# EAGLE design Interfacing board updated (EAGLE 6.2)
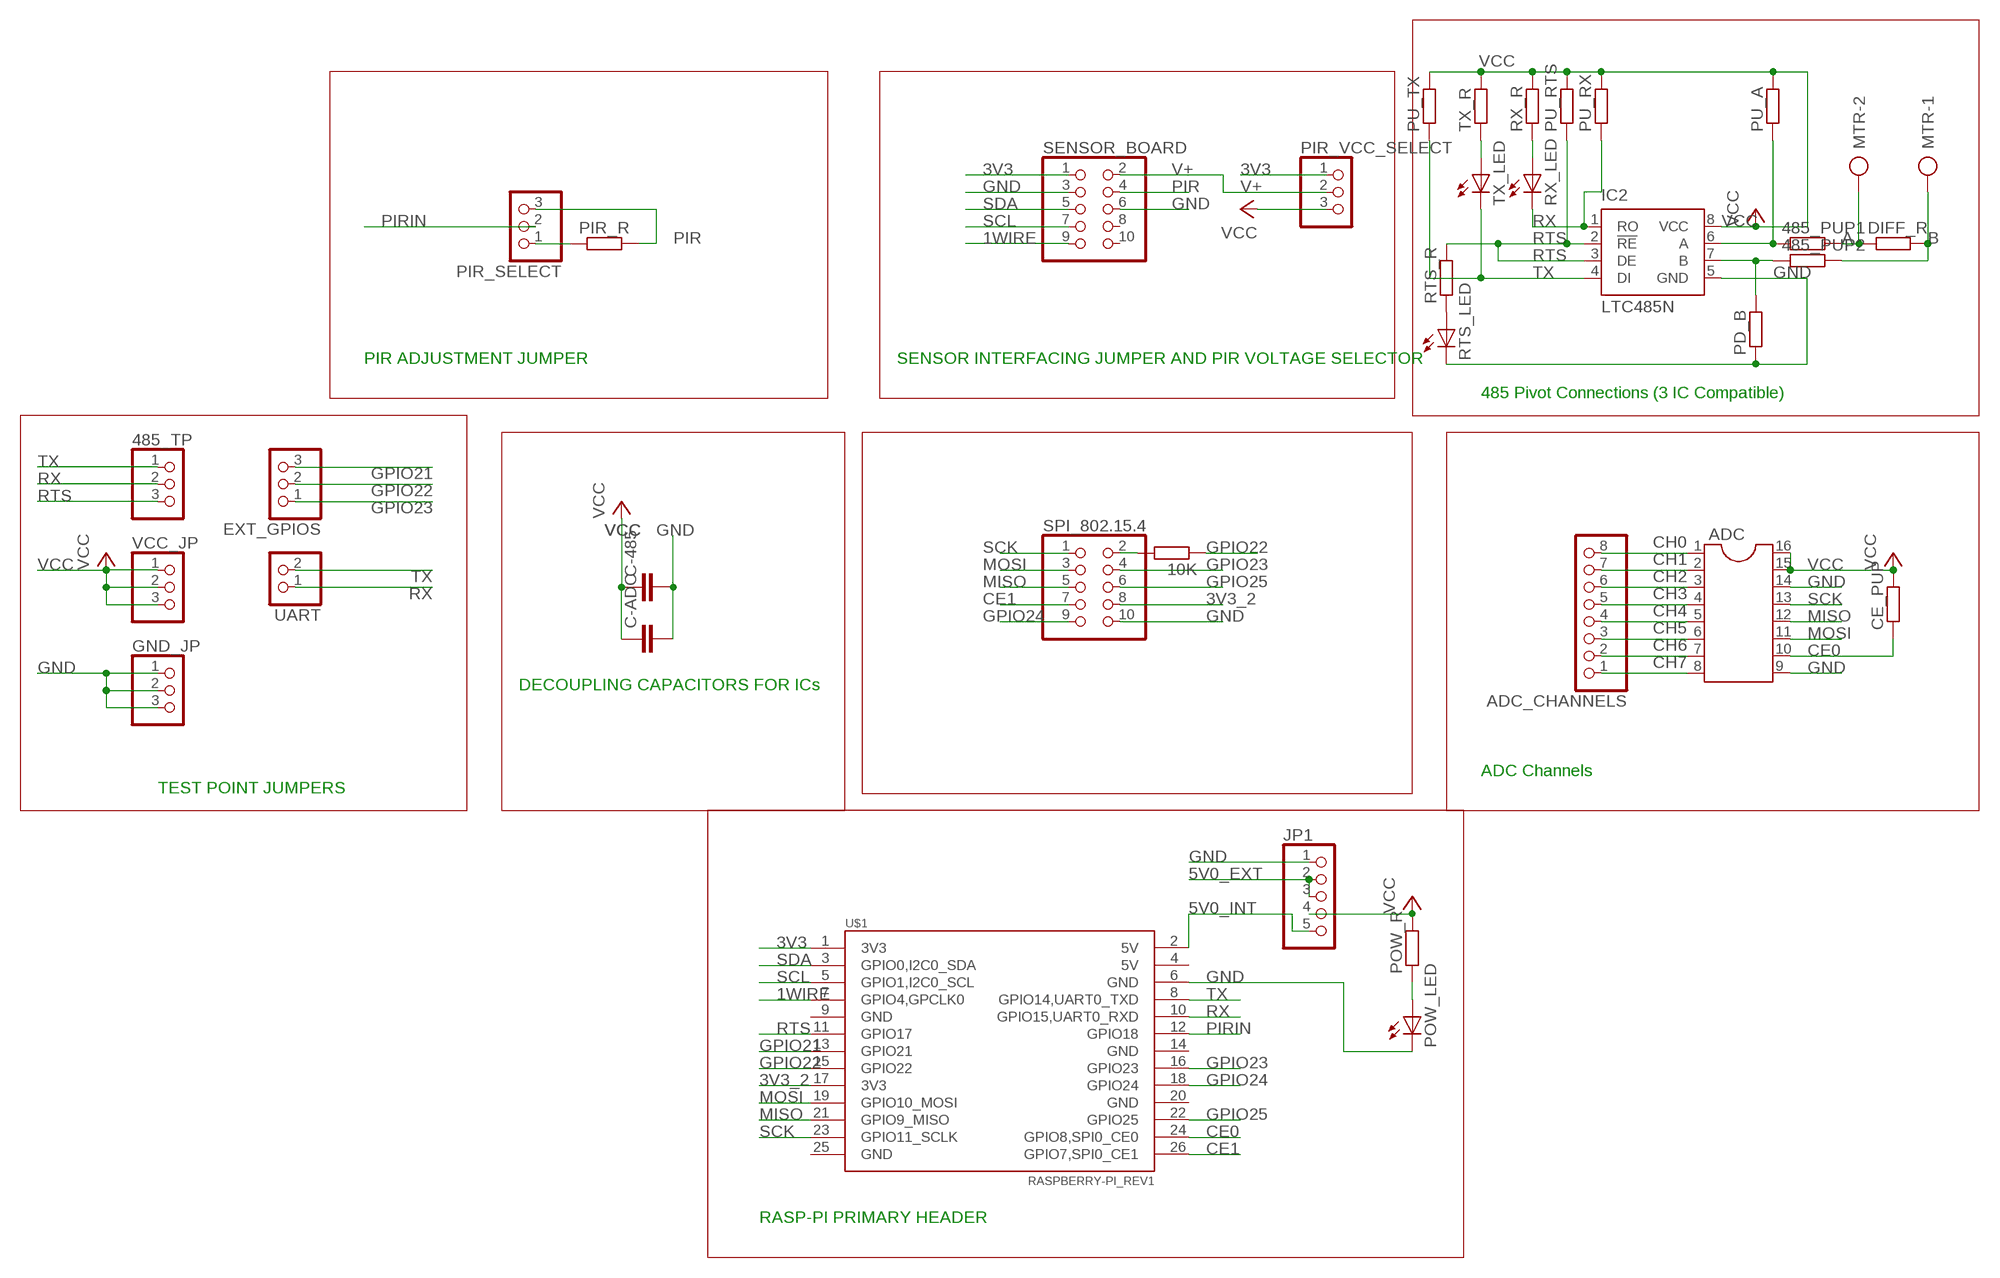
[diagram p0: schematic, sheet 1]

## Parts
10K  R-EU_R0603  [R0603]
485_PUP1  R-EU_R0603  [R0603]
485_PUP2  R-EU_R0603  [R0603]
485_TP  PINHD-1X3/90  [1X03/90]
ADC  DIL16  [DIL16]
ADC_CHANNELS  PINHD-1X8/90  [1X08/90]
C-485  C-EU025-025X050  [C025-025X050]
C-ADC  C-EU025-025X050  [C025-025X050]
CE_PUP  R-EU_R0603  [R0603]
DIFF_R  R-EU_R0603  [R0603]
EXT_GPIOS  PINHD-1X3/90  [1X03/90]
GND_JP  PINHD-1X3/90  [1X03/90]
IC2  LTC485N  [DIL08]
JP1  PINHD-1X5  [1X05]
MTR  AK500/2-H  [AK500/2-H]
PD_B  R-EU_R0603  [R0603]
PIR_R  R-EU_R0603  [R0603]
PIR_SELECT  PINHD-1X3/90  [1X03/90]
PIR_VCC_SELECT  PINHD-1X3/90  [1X03/90]
POW_LED  LEDCHIPLED_0805  [CHIPLED_0805]
POW_R  R-EU_R0603  [R0603]
PU_A  R-EU_R0603  [R0603]
PU_RTS  R-EU_R0603  [R0603]
PU_RX  R-EU_R0603  [R0603]
PU_TX  R-EU_R0603  [R0603]
RTS_LED  LEDCHIPLED_0805  [CHIPLED_0805]
RTS_R  R-EU_R0603  [R0603]
RX_LED  LEDCHIPLED_0805  [CHIPLED_0805]
RX_R  R-EU_R0603  [R0603]
SENSOR_BOARD  PINHD-2X5/90  [2X05/90]
SPI_802.15.4  PINHD-2X5/90  [2X05/90]
TX_LED  LEDCHIPLED_0805  [CHIPLED_0805]
TX_R  R-EU_R0603  [R0603]
U$1  RASPBERRY-PI_REV1  [RASPBERRY-PI_REV1]
UART  PINHD-1X2  [1X02]
VCC_JP  PINHD-1X3/90  [1X03/90]

## Nets
1WIRE: SENSOR_BOARD.9 U$1.7(GPIO4,GPCLK0)
3V3: PIR_VCC_SELECT.1 SENSOR_BOARD.1 U$1.1(3V3)
3V3_2: SPI_802.15.4.8 U$1.17(3V3)
5V0_EXT: JP1.2 JP1.3
5V0_INT: JP1.5 U$1.2(5V)
A: 485_PUP1.2 DIFF_R.1 MTR.2
B: 485_PUP2.2 DIFF_R.2 MTR.1
CE0: ADC.10 CE_PUP.1 U$1.24(GPIO8,SPI0_CE0)
CE1: SPI_802.15.4.7 U$1.26(GPIO7,SPI0_CE1)
CH0: ADC.1 ADC_CHANNELS.8
CH1: ADC.2 ADC_CHANNELS.7
CH2: ADC.3 ADC_CHANNELS.6
CH3: ADC.4 ADC_CHANNELS.5
CH4: ADC.5 ADC_CHANNELS.4
CH5: ADC.6 ADC_CHANNELS.3
CH6: ADC.7 ADC_CHANNELS.2
CH7: ADC.8 ADC_CHANNELS.1
GND: ADC.9 ADC.14 C-485.2 C-ADC.2 GND_JP.1 GND_JP.2 GND_JP.3 IC2.5(GND) JP1.1 PD_B.1 POW_LED.C RTS_LED.C SENSOR_BOARD.3 SENSOR_BOARD.6 SPI_802.15.4.10 U$1.6(GND)
GPIO21: EXT_GPIOS.3 U$1.13(GPIO21)
GPIO22: 10K.1 EXT_GPIOS.2 U$1.15(GPIO22)
GPIO23: EXT_GPIOS.1 SPI_802.15.4.4 U$1.16(GPIO23)
GPIO24: SPI_802.15.4.9 U$1.18(GPIO24)
GPIO25: SPI_802.15.4.6 U$1.22(GPIO25)
MISO: ADC.12 SPI_802.15.4.5 U$1.21(GPIO9_MISO)
MOSI: ADC.11 SPI_802.15.4.3 U$1.19(GPIO10_MOSI)
N$1: 485_PUP1.1 IC2.6(A) PU_A.1
N$2: 485_PUP2.1 IC2.7(B) PD_B.2
N$3: PIR_R.1 PIR_SELECT.1
N$4: POW_LED.A POW_R.1
N$7: RTS_LED.A RTS_R.1
N$14: 10K.2 SPI_802.15.4.2
PIR: PIR_R.2 PIR_SELECT.3 SENSOR_BOARD.4
PIRIN: PIR_SELECT.2 U$1.12(GPIO18)
RTS: 485_TP.3 IC2.2(!RE) IC2.3(DE) PU_RTS.1 RTS_R.2 U$1.11(GPIO17)
RX: 485_TP.2 IC2.1(RO) PU_RX.1 RX_LED.C U$1.10(GPIO15,UART0_RXD) UART.1
RX_R: RX_LED.A RX_R.1
SCK: ADC.13 SPI_802.15.4.1 U$1.23(GPIO11_SCLK)
SCL: SENSOR_BOARD.7 U$1.5(GPIO1,I2C0_SCL)
SDA: SENSOR_BOARD.5 U$1.3(GPIO0,I2C0_SDA)
TX: 485_TP.1 IC2.4(DI) PU_TX.1 TX_LED.C U$1.8(GPIO14,UART0_TXD) UART.2
TX_R: TX_LED.A TX_R.1
V+: PIR_VCC_SELECT.2 SENSOR_BOARD.2
VCC: ADC.15 ADC.16 C-485.1 C-ADC.1 CE_PUP.2 IC2.8(VCC) JP1.4 PIR_VCC_SELECT.3 POW_R.2 PU_A.2 PU_RTS.2 PU_RX.2 PU_TX.2 RX_R.2 TX_R.2 VCC_JP.1 VCC_JP.2 VCC_JP.3
Unconnected: SENSOR_BOARD.8 SENSOR_BOARD.10 U$1.4(5V) U$1.9(GND) U$1.14(GND) U$1.20(GND) U$1.25(GND)

## Notes on the sheet
- PIR ADJUSTMENT JUMPER | SENSOR INTERFACING JUMPER AND PIR VOLTAGE SELECTOR
- 485 Pivot Connections (3 IC Compatible)
- DECOUPLING CAPACITORS FOR ICs
- ADC Channels
- TEST POINT JUMPERS
- RASP-PI PRIMARY HEADER

## Library data of the parts
10K 485_PUP1 485_PUP2 CE_PUP DIFF_R PD_B PIR_R POW_R PU_A PU_RTS PU_RX PU_TX RTS_R RX_R TX_R = rcl:R-EU_: RESISTOR, European symbol
485_TP EXT_GPIOS GND_JP PIR_SELECT PIR_VCC_SELECT VCC_JP = pinhead:PINHD-1X3: PIN HEADER
ADC = ic-package:DIL16: Dual In Line / Socket
ADC_CHANNELS = pinhead:PINHD-1X8: PIN HEADER
C-485 C-ADC = rcl:C-EU: CAPACITOR, European symbol
IC2 = linear-technology:LTC485: Low Power RS485 Interface Transceiver Source: http://www.linear.com/pc/downloadDocument.do?navId=H0,C1,C1007,C1017,P2064,D1718; OC_FARNELL: unknown; OC_NEWARK: unknown
JP1 = pinhead:PINHD-1X5: PIN HEADER
MTR = con-ptr500:AK500/2-H: CONNECTOR Aug. 2004 / PTR Meßtechnik: Die Bezeichnung der Serie AK505 wurde geändert. Es handelt sich hierbei um AK500 in horizontaler Ausführung.; OC_FARNELL: unknown; OC_NEWARK: unknown
POW_LED RTS_LED RX_LED TX_LED = led:LED: LED OSRAM: - CHIPLED LG R971, LG N971, LY N971, LG Q971, LY Q971, LO R971, LY R971 LH N974, LH R974 LS Q976, LO Q976, LY Q976 LO Q996 - Hyper CHIPLED LW Q18S LB Q993, LB Q99A, LB R99A - SideLED LS A670, LO A670, LY A670, LG A670, LP A670 LB A673, LV A673, LT A673, LW A673 LH A674 LY A675 LS A676, LA A676, LO A676, LY A676, LW A676 LS A679, LY A679, LG A679 - Hyper Micro SIDELED® LS Y876, LA Y876, LO Y876, LY Y876 LT Y87S - SmartLED LW L88C, LW L88S LB L89C, LB L89S, LG L890 LS L89K, LO L89K, LY L89K LS L896, LA L896, LO L896, LY L896 - TOPLED LS T670, LO T670, LY T670, LG T670, LP T670 LSG T670, LSP T670, LSY T670, LOP T670, LYG T670 LG T671, LOG T671, LSG T671 LB T673, LV T673, LT T673, LW T673 LH T674 LS T676, LA T676, LO T676, LY T676, LB T676, LH T676, LSB T676, LW T676 LB T67C, LV T67C, LT T67C, LS T67K, LO T67K, LY T67K, LW E67C LS E67B, LA E67B, LO E67B, LY E67B, LB E67C, LV E67C, LT E67C LW T67C LS T679, LY T679, LG T679 LS T770, LO T770, LY T770, LG T770, LP T770 LB T773, LV T773, LT T773, LW T773 LH T774 LS E675, LA E675, LY E675, LS T675 LS T776, LA T776, LO T776, LY T776, LB T776 LHGB T686 LT T68C, LB T68C - Hyper Mini TOPLED® LB M676 - Mini TOPLED Santana® LG M470 LS M47K, LO M47K, LY M47K Source: http://www.osram.convergy.de LUXEON: - LUMILED® LXK2-PW12-R00, LXK2-PW12-S00, LXK2-PW14-U00, LXK2-PW14-V00 LXK2-PM12-R00, LXK2-PM12-S00, LXK2-PM14-U00 LXK2-PE12-Q00, LXK2-PE12-R00, LXK2-PE12-S00, LXK2-PE14-T00, LXK2-PE14-U00 LXK2-PB12-K00, LXK2-PB12-L00, LXK2-PB12-M00, LXK2-PB14-N00, LXK2-PB14-P00, LXK2-PB14-Q00 LXK2-PR12-L00, LXK2-PR12-M00, LXK2-PR14-Q00, LXK2-PR14-R00 LXK2-PD12-Q00, LXK2-PD12-R00, LXK2-PD12-S00 LXK2-PH12-R00, LXK2-PH12-S00 LXK2-PL12-P00, LXK2-PL12-Q00, LXK2-PL12-R00 Source: www.luxeon.com KINGBRIGHT: KA-3528ASYC Source: www.kingbright.com
SENSOR_BOARD SPI_802.15.4 = pinhead:PINHD-2X5: PIN HEADER
U$1 = RaspberryPi:RASPBERRY-PI_REV1: Raspberry Pi Board <http://www.raspberrypi.org/> Jacques Lagnel V1.0 (beta) 2012 Mateusz Bawaj V1.1 (beta) 2012 Board dimension: Forum 3D model <http://www.raspberrypi.org/forum/general-discussion/mechanical-profile-3d-models?value=3d%20model&type=1&include=1&search=1&ret=all> The GPIO Connector (P1): http://elinux.org/RPi_Low-level_peripherals
UART = pinhead:PINHD-1X2: PIN HEADER

## Board
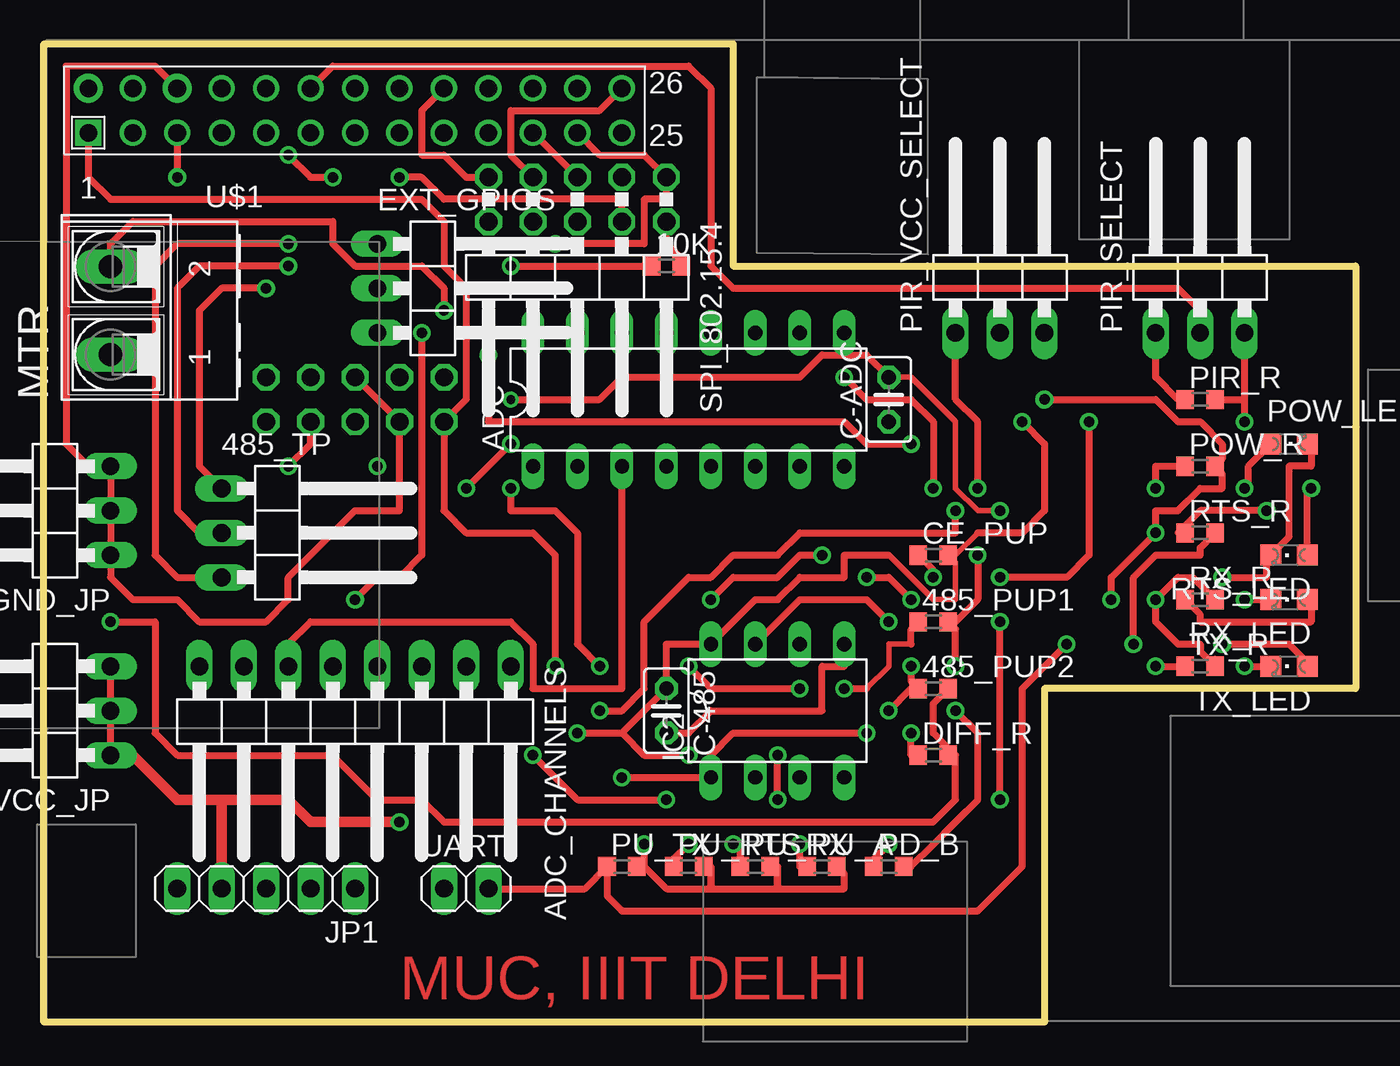
[diagram p1: board, top side]
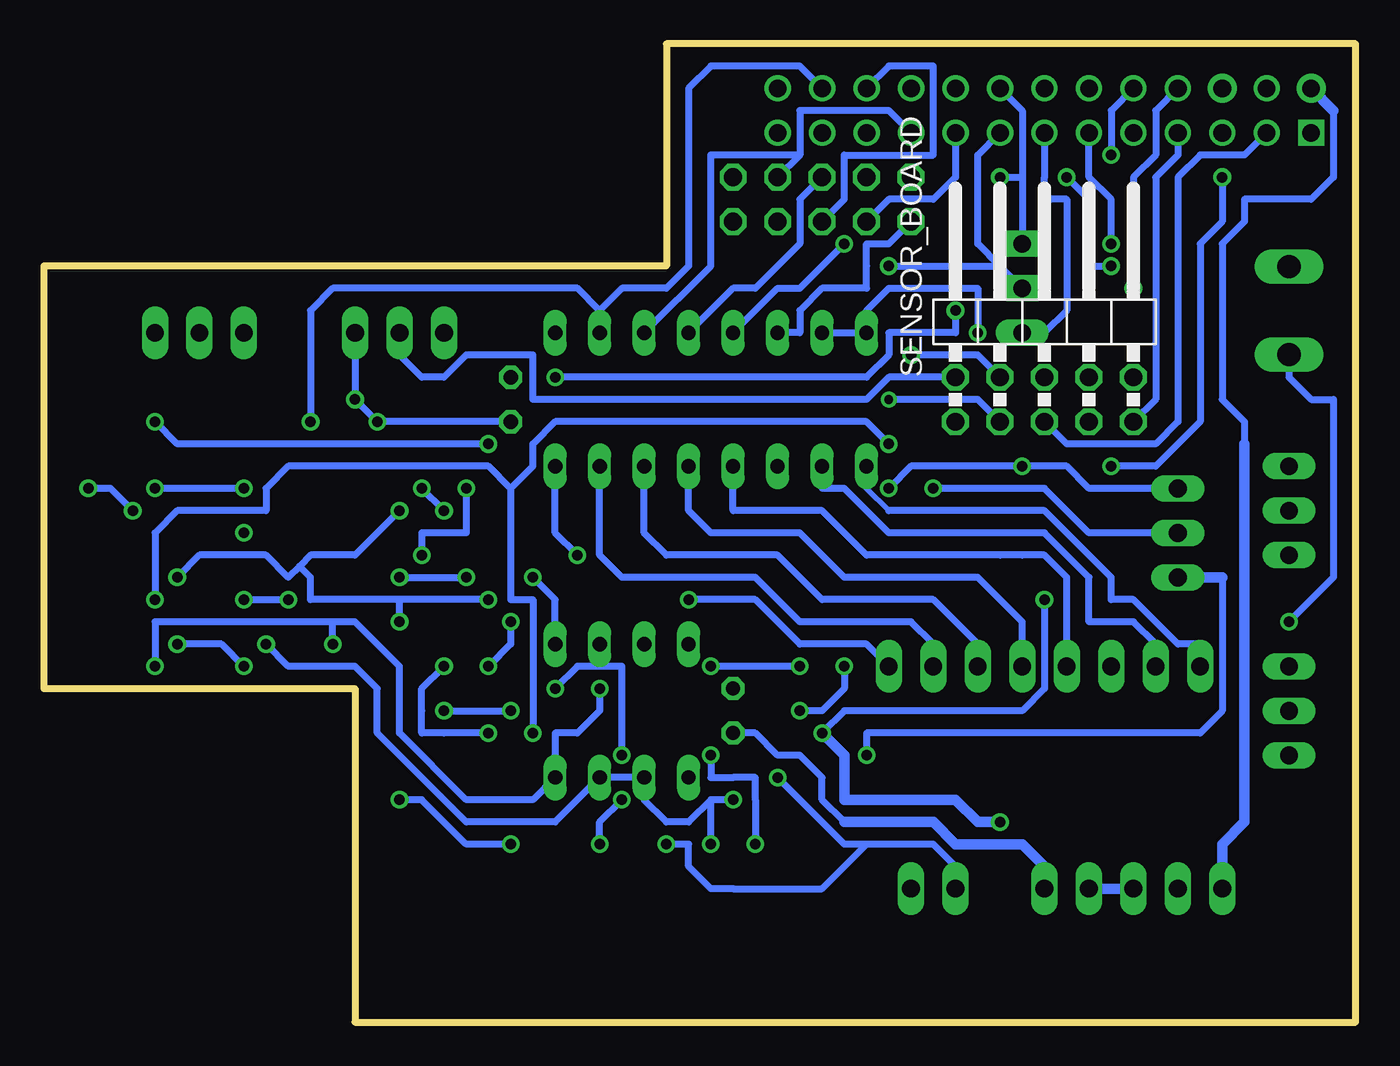
[diagram p2: board, bottom side, seen from below]

Size 74.93 x 55.88 mm. Coordinates in mm from the lower left corner, seen from the top.
Outline: 0,55.88 39.37,55.88 39.37,43.18 74.93,43.18 74.93,19.05 57.15,19.05 57.15,0 0,0 0,55.88
Copper layers (1*16): Top 0.035mm / dielectric 1.5mm / Bottom 0.035mm
Design rules: minimum track width 12mil, minimum drill 15mil, track to track 8mil, track to pad 8mil, pad to pad 8mil, via to via 8mil, smd to smd 8mil, copper to edge 40mil, drill to drill 8mil, minimum pad ring 10mil, minimum via ring 8mil, stop-mask expansion 4mil, vias tented up to drill 0mil, thermal gap 10mil

### Footprints (pad centres in the part's own frame; a part is rotated, then mirrored left to right if it is on the bottom)
R0603 = smd 1 x 1.1: 1 -0.85,0; 2 0.85,0
1X03/90 = drill 1.016 long: 1 -2.54,-3.81; 2 0,-3.81; 3 2.54,-3.81
DIL16 = drill 0.813 long: 1 -8.89,-3.81; 2 -6.35,-3.81; 3 -3.81,-3.81; 4 -1.27,-3.81; 5 1.27,-3.81; 6 3.81,-3.81; 7 6.35,-3.81; 8 8.89,-3.81; 9 8.89,3.81; 10 6.35,3.81; 11 3.81,3.81; 12 1.27,3.81; 13 -1.27,3.81; 14 -3.81,3.81; 15 -6.35,3.81; 16 -8.89,3.81
1X08/90 = drill 1.016 long: 1 -8.89,-3.81; 2 -6.35,-3.81; 3 -3.81,-3.81; 4 -1.27,-3.81; 5 1.27,-3.81; 6 3.81,-3.81; 7 6.35,-3.81; 8 8.89,-3.81
C025-025X050 = drill 0.813 octagon: 1 -1.27,0; 2 1.27,0
DIL08 = drill 0.813 long: 1 -3.81,-3.81; 2 -1.27,-3.81; 3 1.27,-3.81; 4 3.81,-3.81; 5 3.81,3.81; 6 1.27,3.81; 7 -1.27,3.81; 8 -3.81,3.81
1X05 = drill 1.016 long: 1 -5.08,0; 2 -2.54,0; 3 0,0; 4 2.54,0; 5 5.08,0
AK500/2-H = drill 1.321 long: 1 -2.515,0; 2 2.515,0
CHIPLED_0805 = smd 1.2 x 1.2: A 0,-1.05; C 0,1.05
2X05/90 = drill 1.016 octagon: 1 -5.08,-6.35; 2 -5.08,-3.81; 3 -2.54,-6.35; 4 -2.54,-3.81; 5 0,-6.35; 6 0,-3.81; 7 2.54,-6.35; 8 2.54,-3.81; 9 5.08,-6.35; 10 5.08,-3.81
RASPBERRY-PI_REV1 = drill 1 square: 1 -41.91,21.59 | drill 1 pad 1.676: 2 -41.91,24.13; 6 -36.83,24.13 | drill 1: 3 -39.37,21.59; 4 -39.37,24.13; 5 -36.83,21.59; 7 -34.29,21.59; 8 -34.29,24.13; 9 -31.75,21.59; 10 -31.75,24.13; 11 -29.21,21.59; 12 -29.21,24.13; 13 -26.67,21.59; 14 -26.67,24.13; 15 -24.13,21.59; 16 -24.13,24.13; 17 -21.59,21.59; 18 -21.59,24.13; 19 -19.05,21.59; 20 -19.05,24.13; 21 -16.51,21.59; 22 -16.51,24.13; 23 -13.97,21.59; 24 -13.97,24.13; 25 -11.43,21.59; 26 -11.43,24.13
1X02 = drill 1.016 long: 1 -1.27,0; 2 1.27,0

### Placement (x,y rotation side)
10K  35.56,43.18 0 top
485_PUP1  50.8,22.86 0 top
485_PUP2  50.8,19.05 0 top
485_TP  13.97,27.94 270 top
ADC  36.83,35.56 0 top
ADC_CHANNELS  17.78,16.51 180 top
C-485  35.56,17.78 270 top
C-ADC  48.26,35.56 90 top
CE_PUP  50.8,26.67 0 top
DIFF_R  50.8,15.24 0 top
EXT_GPIOS  22.86,41.91 270 top
GND_JP  0,29.21 90 top
IC2  41.91,17.78 0 top
JP1  12.7,7.62 180 top
MTR  3.81,40.64 90 top
PD_B  48.26,8.89 0 top
PIR_R  66.04,35.56 0 top
PIR_SELECT  66.04,43.18 0 top
PIR_VCC_SELECT  54.61,43.18 0 top
POW_LED  71.12,33.02 270 top
POW_R  66.04,31.75 0 top
PU_A  44.45,8.89 0 top
PU_RTS  36.83,8.89 0 top
PU_RX  40.64,8.89 0 top
PU_TX  33.02,8.89 0 top
RTS_LED  71.12,26.67 90 top
RTS_R  66.04,27.94 0 top
RX_LED  71.12,24.13 90 top
RX_R  66.04,24.13 0 top
SENSOR_BOARD  17.78,40.64 0 bottom
SPI_802.15.4  30.48,41.91 180 top
TX_LED  71.12,20.32 90 top
TX_R  66.04,20.32 0 top
U$1  44.45,29.21 0 top
UART  24.13,7.62 0 top
VCC_JP  0,17.78 90 top

### Tracks (layer width: path | path; a pad name or v marks a point on that pad's centre or on a via)
1WIRE
  Bottom 0.406: U$1.7 10.16,49.53 11.43,48.26 11.43,35.56 SENSOR_BOARD.9
3V3  (via drill 0.6)
  Top 0.406: U$1.1 2.54,48.26 3.81,46.99 20.32,46.99 | v29.21,20.32 29.21,26.67 27.94,27.94 24.13,27.94 22.86,29.21 SENSOR_BOARD.1 24.13,35.56 24.13,39.37 24.13,41.91 22.86,43.18 22.86,45.72 21.59,46.99 | v52.07,29.21 52.07,27.94 43.18,27.94 41.91,26.67 39.37,26.67 38.1,25.4 36.83,25.4 34.29,22.86 34.29,19.05 33.02,17.78 v31.75,17.78 | v53.34,30.48 53.34,34.29 52.07,35.56 PIR_VCC_SELECT.1 | 20.32,46.99 21.59,46.99 | 20.32,46.99 21.59,46.99
  Bottom 0.406: v29.21,20.32 29.21,19.05 30.48,17.78 v31.75,17.78 | v52.07,29.21 v53.34,30.48
3V3_2
  Bottom 0.406: SPI_802.15.4.8 26.67,46.99 24.13,46.99 22.86,48.26 U$1.17
5V0_EXT
  Bottom 0.61: JP1.3 JP1.2
5V0_INT
  Bottom 0.406: 1.27,52.07 1.27,48.26 2.54,46.99 6.35,46.99 6.35,45.72 7.62,44.45 7.62,35.56 6.35,34.29 6.35,33.02
  Bottom 0.61: 6.35,33.02 6.35,16.51 6.35,11.43 7.62,10.16 JP1.5 | 1.27,52.07 U$1.2
A  (via drill 0.6)
  Top 0.406: v50.8,30.48 50.8,34.29 49.53,35.56 46.99,35.56 v45.72,36.83 | v53.34,26.67 53.34,24.13 52.07,22.86 485_PUP1.2 52.07,22.44 v52.07,20.32 | DIFF_R.1 49.53,15.24 v49.53,16.51 | MTR.2 3.81,44.45 5.08,45.72 16.51,45.72 16.51,44.45 17.78,43.18 21.59,43.18 22.86,41.91 v22.86,40.64
  Bottom 0.406: v22.86,40.64 22.86,39.37 26.67,39.37 26.67,38.1 27.94,36.83 v45.72,36.83 | v53.34,26.67 53.34,27.94 50.8,27.94 v50.8,30.48 | v52.07,20.32 53.34,19.05 53.34,17.78 53.34,16.51 52.07,16.51 v49.53,16.51
B  (via drill 0.6)
  Top 0.406: v3.81,22.86 6.35,22.86 6.35,16.51 7.62,15.24 16.51,15.24 19.05,12.7 21.59,12.7 22.86,11.43 50.8,11.43 52.07,12.7 52.07,15.24 DIFF_R.2 51.65,15.66 50.8,16.51 50.8,18.2 485_PUP2.2
  Bottom 0.406: MTR.1 3.81,36.83 2.54,35.56 1.27,35.56 1.27,25.4 v3.81,22.86
CE0  (via drill 0.6)
  Top 0.406: v59.69,34.29 59.69,26.67 58.42,25.4 v54.61,25.4 | v50.8,25.4 50.8,25.82 CE_PUP.1
  Bottom 0.406: ADC.10 43.18,40.64 | 43.18,40.64 41.91,41.91 39.37,41.91 38.1,43.18 38.1,50.8 38.1,53.34 36.83,54.61 34.29,54.61 31.75,54.61 U$1.24 | 43.18,40.64 44.45,41.91 58.42,41.91 59.69,40.64 v59.69,34.29 | v54.61,25.4 v50.8,25.4
CE1
  Top 0.406: U$1.26 31.75,52.07 26.67,52.07 26.67,49.53 SPI_802.15.4.7
CH0
  Bottom 0.305: 26.67,29.21 27.94,30.48 ADC.1
  Bottom 0.406: ADC_CHANNELS.8 8.89,21.59 10.16,21.59 12.7,24.13 13.97,24.13 13.97,25.4 17.78,29.21 26.67,29.21
CH1
  Bottom 0.406: ADC_CHANNELS.7 11.43,21.59 12.7,22.86 15.24,22.86 15.24,25.4 17.78,27.94 26.67,27.94 29.21,30.48 30.48,30.48 ADC.2
CH2
  Top 0.406: ADC_CHANNELS.6 13.97,21.59 15.24,22.86 26.67,22.86 27.94,21.59 27.94,19.05 33.02,19.05 ADC.3
CH3
  Bottom 0.406: ADC_CHANNELS.5 16.51,25.4 17.78,26.67 19.05,26.67 20.32,26.67 27.94,26.67 30.48,29.21 35.56,29.21 ADC.4
CH4
  Bottom 0.406: ADC_CHANNELS.4 19.05,22.86 21.59,25.4 29.21,25.4 31.75,27.94 36.83,27.94 38.1,29.21 ADC.5
CH5
  Bottom 0.406: ADC_CHANNELS.3 21.59,21.59 24.13,24.13 30.48,24.13 33.02,26.67 39.37,26.67 40.64,27.94 ADC.6
CH6
  Bottom 0.406: ADC_CHANNELS.2 24.13,21.59 25.4,22.86 31.75,22.86 34.29,25.4 41.91,25.4 43.18,26.67 ADC.7
CH7  (via drill 0.6)
  Top 0.406: v38.1,24.13 39.37,25.4 41.91,25.4 43.18,26.67 v44.45,26.67
  Bottom 0.406: ADC_CHANNELS.1 27.94,21.59 31.75,21.59 34.29,24.13 v38.1,24.13 | v44.45,26.67 45.72,27.94 ADC.8
GND  (via drill 0.5 pad 0.13, 0.6, 0.6 pad 0.41)
  Top 0.305: C-ADC.2 49.53,36.83 52.07,34.29 52.07,30.48 53.34,29.21 v54.61,29.21
  Top 0.406: U$1.6 6.35,54.61 1.27,54.61 1.27,33.02 2.54,31.75 GND_JP.3 | GND_JP.3 GND_JP.2 GND_JP.1 | GND_JP.3 3.81,25.4 5.08,24.13 7.62,24.13 8.89,22.86 12.7,22.86 13.97,24.13 13.97,25.4 17.78,29.21 20.32,29.21 SENSOR_BOARD.3 SENSOR_BOARD.6 | v26.67,35.56 31.75,35.56 33.02,36.83 | ADC.14 33.02,36.83 | 33.02,36.83 43.18,36.83 44.45,38.1 45.72,38.1 | ADC.9 45.72,38.1 | 45.72,38.1 46.99,38.1 C-ADC.2 | C-485.2 36.83,16.51 38.1,17.78 44.45,17.78 44.45,20.32 45.72,20.32 IC2.5 | v46.99,25.4 48.26,25.4 v49.53,24.13 | v67.31,25.4 69.85,25.4 69.85,26.45 RTS_LED.C 71.12,27.72 71.12,31.75 72.39,31.75 72.39,32.8 POW_LED.C | PD_B.1 47.41,9.31 v48.26,10.16 | v54.61,12.7 v54.61,22.86
  Bottom 0.406: SENSOR_BOARD.3 21.59,35.56 v26.67,35.56 | IC2.5 45.72,24.13 v46.99,25.4 | v49.53,24.13 54.61,24.13 | 54.61,24.13 59.69,24.13 59.69,25.4 60.33,26.04 | v54.61,29.21 57.15,26.67 59.69,26.67 60.33,26.04 | 60.33,26.04 60.96,25.4 62.23,26.67 66.04,26.67 v67.31,25.4 | C-485.2 34.29,16.51 33.02,15.24 31.75,15.24 30.48,13.97 30.48,12.7 29.21,11.43 | v48.26,10.16 50.8,10.16 53.34,12.7 v54.61,12.7 | v54.61,22.86 54.61,24.13 | ADC.14 31.75,39.37 31.75,40.64 30.48,41.91 27.94,41.91 27.94,43.18 27.94,44.45 26.67,44.45 SPI_802.15.4.10
  Bottom 0.61: JP1.1 17.78,8.89 19.05,10.16 22.86,10.16 24.13,11.43 29.21,11.43
GPIO21
  Bottom 0.406: U$1.13 17.78,48.26 17.78,46.99 16.51,46.99 16.51,40.64 17.78,39.37 EXT_GPIOS.3
GPIO22  (via drill 0.6)
  Top 0.406: v26.67,43.18 10K.1
  Bottom 0.406: EXT_GPIOS.2 20.32,43.18 | U$1.15 21.59,49.53 21.59,44.45 20.32,43.18 | v26.67,43.18 20.32,43.18
GPIO23  (via drill 0.6)
  Top 0.406: SPI_802.15.4.4 33.02,46.99 22.86,46.99 21.59,48.26 v20.32,48.26
  Bottom 0.406: U$1.16 19.05,52.07 19.05,48.26 | 19.05,48.26 EXT_GPIOS.1 | v20.32,48.26 19.05,48.26
GPIO24
  Top 0.406: U$1.18 21.59,52.07 21.59,49.53 22.86,49.53 24.13,48.26 SPI_802.15.4.9
GPIO25
  Bottom 0.406: SPI_802.15.4.6 29.21,46.99 29.21,49.53 24.13,49.53 24.13,52.07 24.13,54.61 26.67,54.61 U$1.22
MISO
  Top 0.406: U$1.21 SPI_802.15.4.5
  Bottom 0.406: SPI_802.15.4.5 31.75,46.99 31.75,44.45 33.02,43.18 34.29,41.91 35.56,41.91 ADC.12
MOSI
  Bottom 0.406: 31.75,49.53 SPI_802.15.4.3 31.75,49.53 | ADC.11 36.83,43.18 36.83,49.53 31.75,49.53 | U$1.19 26.67,52.07 31.75,52.07 31.75,49.53
N$1  (via drill 0.6, 0.6 pad 0.41)
  Top 0.305: 46.99,19.05 48.26,20.32 48.26,21.59 49.53,21.59
  Top 0.406: v45.72,19.05 46.99,19.05 | 49.53,21.59 49.53,22.44 485_PUP1.1 | PU_A.1 43.18,8.89 v43.18,10.16 | v41.91,12.7 v41.91,15.24
  Bottom 0.406: 43.18,20.32 IC2.6 | v43.18,10.16 43.18,11.43 v41.91,12.7 | v41.91,15.24 41.91,19.05 41.91,20.32 43.18,20.32 | 43.18,20.32 44.45,20.32 v45.72,19.05
N$2  (via drill 0.6, 0.6 pad 0.41)
  Top 0.406: IC2.7 43.18,24.13 46.99,24.13 v48.26,22.86 | v49.53,20.32 49.53,19.47 485_PUP2.1 49.53,19.05 v48.26,17.78 | PD_B.2 49.53,8.89 50.8,10.16 | 50.8,10.16 52.07,11.43 | 52.07,11.43 53.34,12.7 | 53.34,12.7 52.07,11.43 | 52.07,11.43 50.8,10.16 | 50.8,10.16 53.34,12.7 | 53.34,12.7 53.34,16.51 v52.07,17.78
  Bottom 0.406: v49.53,20.32 48.26,21.59 v48.26,22.86 | v52.07,17.78 v48.26,17.78
N$3
  Top 0.406: PIR_R.1 64.77,35.56 63.5,36.83 PIR_SELECT.1
N$4  (via drill 0.6)
  Top 0.406: 64.77,31.75 POW_R.1 63.5,31.75 v63.5,30.48 | v68.58,30.48 68.8,30.48 68.8,31.75 POW_LED.A
  Bottom 0.406: v63.5,30.48 v68.58,30.48
N$7  (via drill 0.6)
  Top 0.406: v69.85,29.21 66.04,29.21 64.77,27.94 RTS_R.1 | RTS_LED.A 72.17,30.26 v72.39,30.48
  Bottom 0.406: v69.85,29.21 71.12,30.48 v72.39,30.48
N$14
  Top 0.406: 10K.2 36.41,43.6 35.56,44.45 SPI_802.15.4.2
PIR  (via drill 0.6)
  Top 0.406: v49.53,33.02 46.99,33.02 45.72,34.29 25.4,34.29 v25.4,38.1 | PIR_R.2 68.58,35.56 | 68.58,35.56 v68.58,34.29 | PIR_SELECT.3 68.58,35.56
  Bottom 0.406: SENSOR_BOARD.4 21.59,38.1 v25.4,38.1 | v49.53,33.02 67.31,33.02 v68.58,34.29
PIRIN
  Top 0.406: U$1.12 16.51,54.61 36.83,54.61 38.1,53.34 38.1,43.18 39.37,41.91 64.77,41.91 66.04,40.64 PIR_SELECT.2
RTS  (via drill 0.6, 0.6 pad 0.41)
  Top 0.406: v13.97,44.45 7.62,44.45 6.35,43.18 6.35,26.67 7.62,25.4 485_TP.3 | v35.56,12.7 30.48,12.7 29.21,13.97 v27.94,15.24 | RTS_R.2 66.04,27.09 66.04,26.67 63.5,26.67 62.23,25.4 v62.23,21.59 | PU_RTS.1 35.98,9.31 v36.83,10.16
  Bottom 0.406: 7.62,25.4 7.62,17.78 8.89,16.51 27.94,16.51 v27.94,15.24 | v35.56,12.7 36.83,12.7 | 36.83,12.7 38.1,11.43 39.37,11.43 40.64,12.7 IC2.2 IC2.3 45.72,11.43 50.8,11.43 55.88,16.51 55.88,19.05 57.15,20.32 60.96,20.32 v62.23,21.59 | v36.83,10.16 36.83,12.7 | U$1.11 15.24,48.26 13.97,46.99 v13.97,44.45
  Bottom 0.61: 485_TP.3 7.62,25.4
RX  (via drill 0.6, 0.6 pad 0.41)
  Top 0.406: v13.97,49.53 15.24,48.26 v16.51,48.26 | 485_TP.2 8.89,27.94 7.62,29.21 7.62,41.91 8.89,43.18 v13.97,43.18 | v68.58,24.13 RX_LED.C | v24.13,30.48 v26.67,33.02 | v33.02,13.97 IC2.1 38.1,15.24 39.37,16.51 v46.99,16.51 | PU_RX.1 39.79,9.74 v39.37,10.16
  Bottom 0.406: U$1.10 13.97,52.07 v13.97,49.53 | 485_TP.2 15.24,27.94 17.78,30.48 v24.13,30.48 | v68.58,24.13 68.58,27.94 67.31,29.21 62.23,29.21 62.23,30.48 60.96,31.75 49.53,31.75 48.26,30.48 | v26.67,33.02 27.94,34.29 45.72,34.29 46.99,33.02 46.99,31.75 48.26,30.48 | 48.26,30.48 48.26,24.13 46.99,24.13 v46.99,16.51 | UART.1 22.86,8.89 24.13,10.16 27.94,10.16 | 27.94,10.16 29.21,10.16 v33.02,13.97 | 27.94,10.16 30.48,7.62 35.56,7.62 36.83,7.62 38.1,8.89 38.1,10.16 v39.37,10.16 | v16.51,48.26 15.24,46.99 15.24,43.18 v13.97,43.18
RX_R
  Top 0.406: RX_LED.A 72.39,24.13 72.39,22.86 66.04,22.86 66.04,23.28 RX_R.1
SCK  (via drill 0.6)
  Top 0.406: U$1.23 31.75,49.53 34.29,49.53 SPI_802.15.4.1 35.56,46.99 34.29,46.99 34.29,44.45 v29.21,44.45
  Bottom 0.406: ADC.13 33.02,41.91 31.75,41.91 v29.21,44.45
SCL  (via drill 0.6)
  Top 0.406: U$1.5 v7.62,48.26 | v13.97,31.75 15.24,33.02 SENSOR_BOARD.7
  Bottom 0.406: v7.62,48.26 7.62,45.72 8.89,44.45 8.89,34.29 11.43,31.75 v13.97,31.75
SDA
  Bottom 0.406: U$1.3 6.35,49.53 8.89,49.53 10.16,48.26 10.16,34.29 11.43,33.02 16.51,33.02 SENSOR_BOARD.5
TX  (via drill 0.6, 0.6 pad 0.41)
  Top 0.406: v12.7,41.91 10.16,41.91 8.89,40.64 8.89,31.75 485_TP.1 | v31.75,20.32 30.48,21.59 30.48,27.94 29.21,29.21 26.67,29.21 v26.67,30.48 | v68.58,20.32 TX_LED.C | UART.2 30.9,7.62 PU_TX.1 | v36.83,20.32 38.1,19.05 v43.18,19.05 | PU_TX.1 32.17,8.47 | PU_TX.1 32.17,7.2 33.02,6.35 53.34,6.35 55.88,8.89 55.88,19.05 v58.42,21.59
  Bottom 0.406: U$1.8 11.43,52.07 11.43,49.53 12.7,48.26 v12.7,41.91 | 485_TP.1 15.24,30.48 16.51,31.75 v19.05,31.75 25.4,31.75 v26.67,30.48 | v31.75,20.32 v36.83,20.32 | IC2.4 45.72,16.51 44.45,16.51 43.18,17.78 v43.18,19.05 | 45.72,15.24 IC2.4 | IC2.4 46.99,12.7 50.8,12.7 54.61,16.51 54.61,20.32 57.15,22.86 58.42,22.86 | v68.58,20.32 68.58,22.86 58.42,22.86 | v58.42,21.59 58.42,22.86
TX_R  (via drill 0.6)
  Top 0.406: TX_LED.A 72.17,20.54 71.12,21.59 v67.31,21.59 | v63.5,20.32 TX_R.1
  Bottom 0.406: v63.5,20.32 64.77,21.59 v67.31,21.59
V+
  Bottom 0.406: SENSOR_BOARD.2 26.67,36.83 27.94,35.56 46.99,35.56 46.99,38.1 50.8,38.1 52.07,36.83 53.34,36.83 54.61,38.1 PIR_VCC_SELECT.2
VCC  (via drill 0.6, 0.6 pad 0.41)
  Top 0.305: 48.26,26.67 50.8,24.13 52.07,24.13 52.07,26.25 51.65,26.25 CE_PUP.2 52.07,26.67 53.34,27.94
  Top 0.406: VCC_JP.1 VCC_JP.2 VCC_JP.3 | v17.78,24.13 19.05,25.4 20.32,25.4 21.59,26.67 v21.59,39.37 | v30.48,16.51 33.02,16.51 | 33.02,16.51 C-485.1 35.56,21.59 IC2.8 40.64,24.13 41.91,24.13 43.18,25.4 45.72,25.4 45.72,26.67 48.26,26.67 | v55.88,34.29 57.15,33.02 57.15,29.21 55.88,27.94 53.34,27.94 | v57.15,35.56 63.5,35.56 64.77,34.29 66.04,34.29 67.31,33.02 67.31,32.17 POW_R.2 67.31,31.33 67.31,30.48 66.04,30.48 64.77,29.21 63.5,29.21 v63.5,27.94 60.96,25.4 v60.96,24.13 | 66.89,20.74 TX_R.2 66.04,21.17 66.04,21.59 64.77,21.59 63.5,22.86 v63.5,24.13 64.77,25.4 65.62,25.4 RX_R.2 | v34.29,10.16 34.29,9.31 | 34.29,9.31 PU_TX.2 | 34.29,9.31 34.29,8.89 35.56,7.62 38.1,7.62 | 38.1,7.62 38.1,8.47 PU_RTS.2 38.1,8.89 38.1,7.62 | 38.1,7.62 41.91,7.62 | 41.91,7.62 41.91,8.47 PU_RX.2 41.91,8.89 41.91,7.62 | 41.91,7.62 45.72,7.62 45.72,8.47 PU_A.2 | 33.02,16.51 34.29,15.24 v36.83,15.24
  Top 0.61: VCC_JP.1 5.08,15.24 7.62,12.7 | 7.62,12.7 13.97,12.7 15.24,11.43 v20.32,11.43 | 7.62,12.7 10.16,12.7 JP1.4
  Bottom 0.406: ADC.15 ADC.16 27.94,40.64 26.67,41.91 21.59,41.91 v21.59,39.37 | v17.78,24.13 17.78,19.05 19.05,17.78 29.21,17.78 v30.48,16.51 | C-ADC.1 v55.88,34.29 v57.15,35.56 PIR_VCC_SELECT.3 | v63.5,24.13 v60.96,24.13 | v34.29,10.16 34.29,12.7 34.29,13.97 35.56,13.97 36.83,13.97 v36.83,15.24
  Bottom 0.61: v20.32,11.43 21.59,11.43 22.86,12.7 29.21,12.7 29.21,15.24 v30.48,16.51

### Text on the board
Top: MUC, IIIT DELHI